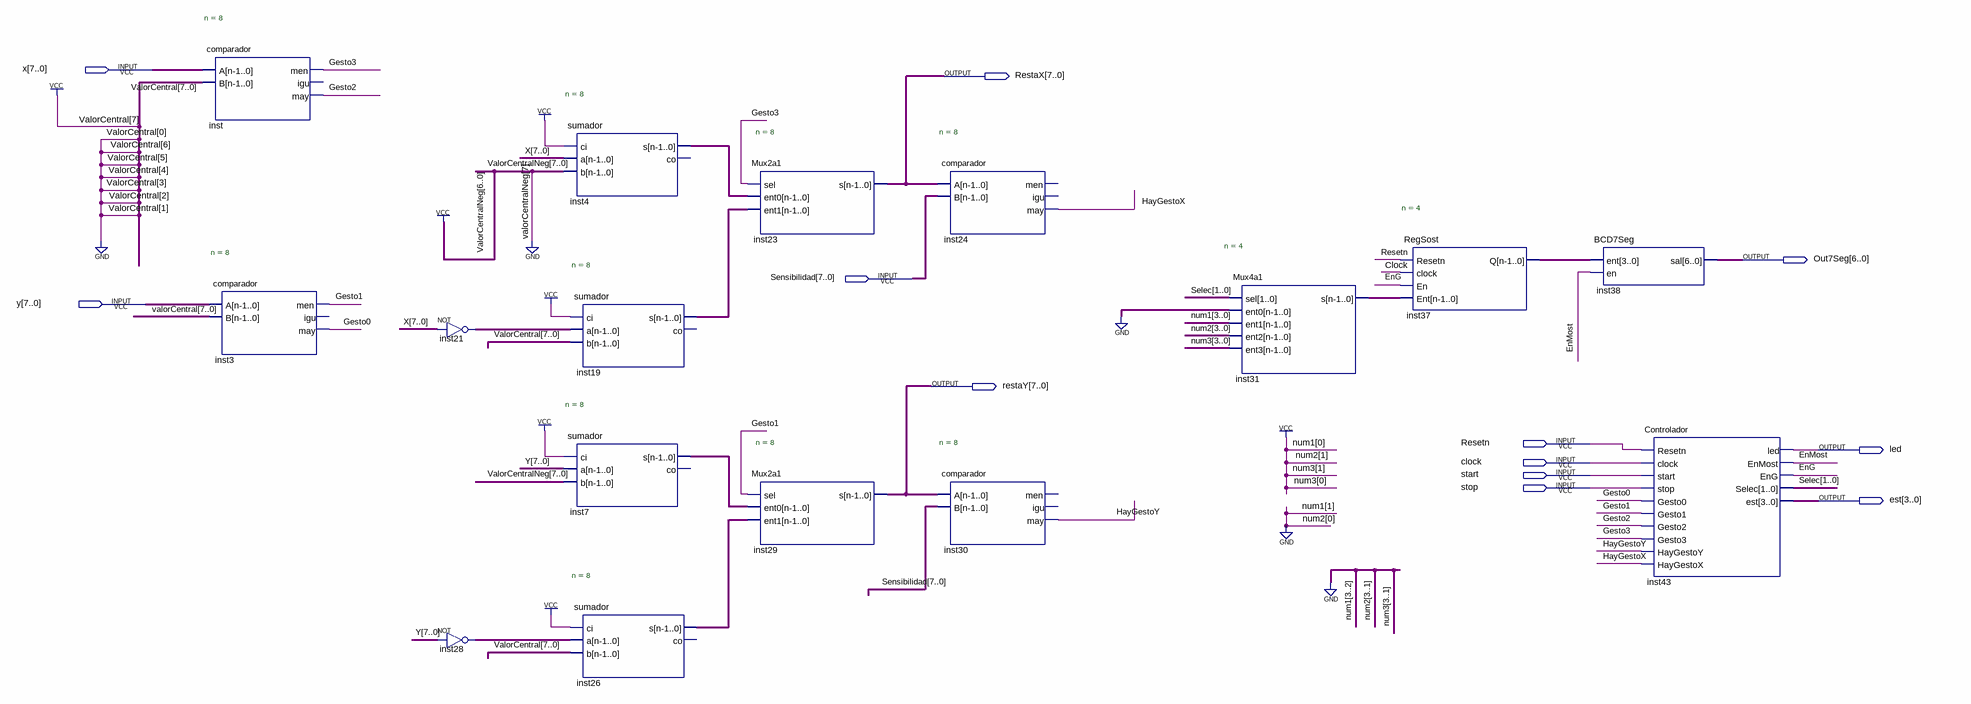
[diagram p0: schematic sheet]
// Quartus schematic Gestos.bdf as structural Verilog: 16 symbols, 12 pins
module Gestos (
  input  [7:0] x,
  input  [7:0] Sensibilidad,
  input  [7:0] y,
  input  Resetn,
  input  clock,
  input  start,
  input  stop,
  output [7:0] RestaX,
  output [6:0] Out7Seg,
  output [7:0] restaY,
  output led,
  output [3:0] est
);

  wire EnG, EnMost, Gesto0, Gesto1, Gesto2, Gesto3, HayGestoX, HayGestoY;
  wire [1:0] Selec;
  wire [3:0] inst31_s, inst37_q;
  wire [3:2] num1, num3;
  wire [7:0] inst4_s, inst7_s, inst19_s, inst21_out, inst26_s, inst28_out;

  comparador #(.n(8)) inst (.A(x), .B(8'b10000000), .men(Gesto3), .may(Gesto2));  // open: igu
  comparador #(.n(8)) inst3 (.A(y), .B(8'b10000000), .men(Gesto1), .may(Gesto0));  // open: igu
  assign inst21_out = ~x;  // NOT inst21, 8 bits wide
  assign inst28_out = ~y;  // NOT inst28, 8 bits wide
  sumador #(.n(8)) inst4 (.ci(1'b1), .a(x), .b(8'b01111111), .s(inst4_s));  // open: co
  sumador #(.n(8)) inst19 (.ci(1'b1), .a(inst21_out), .b(8'b10000000), .s(inst19_s));  // open: co
  sumador #(.n(8)) inst7 (.ci(1'b1), .a(y), .b(8'b01111111), .s(inst7_s));  // open: co
  sumador #(.n(8)) inst26 (.ci(1'b1), .a(inst28_out), .b(8'b10000000), .s(inst26_s));  // open: co
  Mux2a1 #(.n(8)) inst23 (.sel(Gesto3), .ent0(inst4_s), .ent1(inst19_s), .s(RestaX));
  Mux2a1 #(.n(8)) inst29 (.sel(Gesto1), .ent0(inst7_s), .ent1(inst26_s), .s(restaY));
  comparador #(.n(8)) inst24 (.A(RestaX), .B(Sensibilidad), .may(HayGestoX));  // open: men, igu
  comparador #(.n(8)) inst30 (.A(restaY), .B(Sensibilidad), .may(HayGestoY));  // open: men, igu
  Mux4a1 #(.n(4)) inst31 (
    .sel(Selec), .ent0(4'b0000), .ent1({num1, 2'b00}), .ent2(4'b0000), .ent3({num3, 2'b00}), .s(inst31_s));
  RegSost #(.n(4)) inst37 (.Resetn(Resetn), .clock(clock), .En(EnG), .Ent(inst31_s), .Q(inst37_q));
  BCD7Seg inst38 (.ent(inst37_q), .en(EnMost), .sal(Out7Seg));
  Controlador inst43 (
    .Resetn(Resetn), .clock(clock), .start(start), .stop(stop), .Gesto0(Gesto0), .Gesto1(Gesto1),
    .Gesto2(Gesto2), .Gesto3(Gesto3), .HayGestoY(HayGestoY), .HayGestoX(HayGestoX), .led(led),
    .EnMost(EnMost), .EnG(EnG), .Selec(Selec), .est(est));
endmodule
